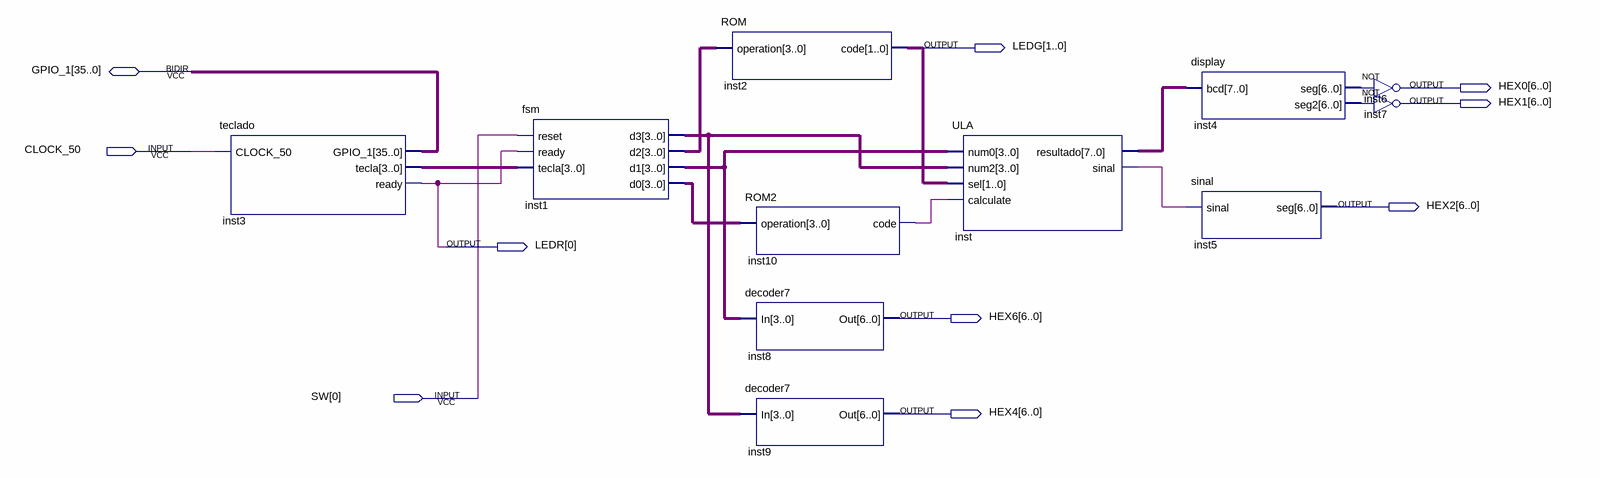
[diagram p0: schematic sheet]
// Quartus schematic top.bdf as structural Verilog: 11 symbols, 10 pins
module top (
  input  CLOCK_50,
  input  [0:0] SW,
  inout  [35:0] GPIO_1,
  output [1:0] LEDG,
  output [6:0] HEX0,
  output [6:0] HEX1,
  output [6:0] HEX2,
  output [0:0] LEDR,
  output [6:0] HEX6,
  output [6:0] HEX4
);

  wire inst10_code, inst_sinal;
  wire [3:0] inst1_d0, inst1_d1, inst1_d2, inst1_d3, inst3_tecla;
  wire [6:0] inst4_seg, inst4_seg2;
  wire [7:0] inst_resultado;

  teclado inst3 (.CLOCK_50(CLOCK_50), .tecla(inst3_tecla), .ready(LEDR[0]), .GPIO_1(GPIO_1));
  fsm inst1 (
    .reset(SW[0]), .ready(LEDR[0]), .tecla(inst3_tecla), .d3(inst1_d3), .d2(inst1_d2), .d1(inst1_d1),
    .d0(inst1_d0));
  ROM inst2 (.operation(inst1_d2), .code(LEDG));
  ROM2 inst10 (.operation(inst1_d0), .code(inst10_code));
  decoder7 inst8 (.In(inst1_d1), .Out(HEX6));
  decoder7 inst9 (.In(inst1_d3), .Out(HEX4));
  ULA inst (
    .num0(inst1_d1), .num2(inst1_d3), .sel(LEDG), .calculate(inst10_code), .resultado(inst_resultado),
    .sinal(inst_sinal));
  display inst4 (.bcd(inst_resultado), .seg(inst4_seg), .seg2(inst4_seg2));
  sinal inst5 (.sinal(inst_sinal), .seg(HEX2));
  assign HEX0 = ~inst4_seg;  // NOT inst6, 7 bits wide
  assign HEX1 = ~inst4_seg2;  // NOT inst7, 7 bits wide
endmodule
